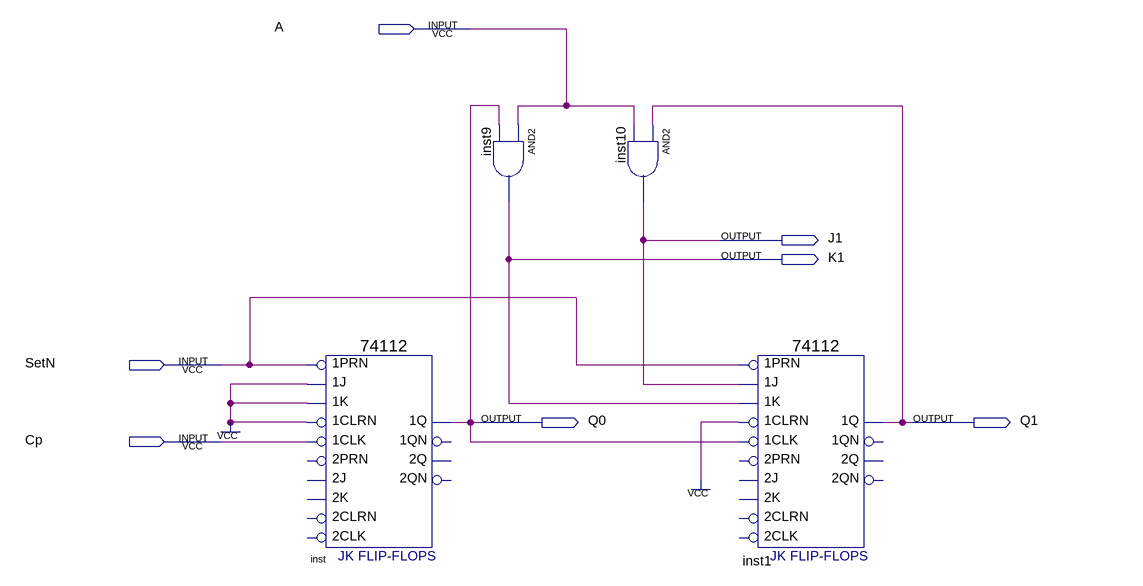
[diagram p0: schematic sheet]
// Quartus schematic Seq_exam.bdf as structural Verilog: 4 symbols, 7 pins
module Seq_exam (
  input  A,
  input  SetN,
  input  Cp,
  output J1,
  output K1,
  output Q0,
  output Q1
);

  \74112  inst (
    .\1K (1'b1), .\1J (1'b1), .\1PRN (SetN), .\1CLK (Cp), .\1CLRN (1'b1), .\1Q (Q0));  // open: 2K, 2J, 2PRN, 2CLK, 2CLRN, 1QN, 2Q, 2QN
  and inst9 (K1, A, Q0);
  and inst10 (J1, Q1, A);
  \74112  inst1 (
    .\1K (K1), .\1J (J1), .\1PRN (SetN), .\1CLK (Q0), .\1CLRN (1'b1), .\1Q (Q1));  // open: 2K, 2J, 2PRN, 2CLK, 2CLRN, 1QN, 2Q, 2QN
endmodule
